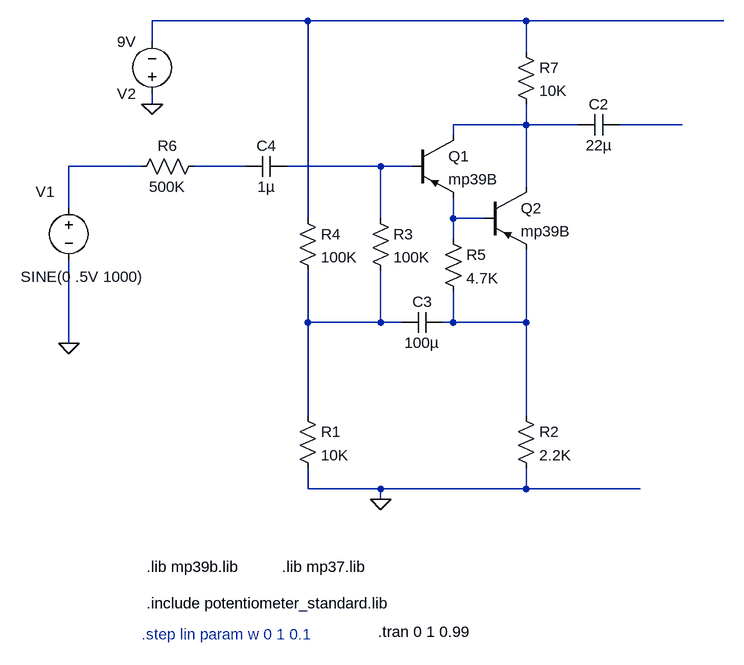
[diagram p0: schematic clean-preamp v3.asc]
clean-preamp v3.asc, the LTspice schematic file:
Version 4
SHEET 1 880 680
WIRE -1184 -912 -1424 -912
WIRE -848 -912 -1184 -912
WIRE -544 -912 -848 -912
WIRE -1424 -880 -1424 -912
WIRE -848 -864 -848 -912
WIRE -1424 -784 -1424 -800
WIRE -848 -752 -848 -784
WIRE -848 -752 -960 -752
WIRE -768 -752 -848 -752
WIRE -608 -752 -704 -752
WIRE -960 -736 -960 -752
WIRE -1440 -688 -1552 -688
WIRE -1280 -688 -1360 -688
WIRE -1072 -688 -1216 -688
WIRE -1024 -688 -1072 -688
WIRE -848 -656 -848 -752
WIRE -1552 -624 -1552 -688
WIRE -1184 -608 -1184 -912
WIRE -1072 -608 -1072 -688
WIRE -960 -608 -960 -640
WIRE -912 -608 -960 -608
WIRE -960 -576 -960 -608
WIRE -1184 -448 -1184 -528
WIRE -1072 -448 -1072 -528
WIRE -1072 -448 -1184 -448
WIRE -1040 -448 -1072 -448
WIRE -960 -448 -960 -496
WIRE -960 -448 -976 -448
WIRE -848 -448 -848 -560
WIRE -848 -448 -960 -448
WIRE -1552 -416 -1552 -544
WIRE -1184 -304 -1184 -448
WIRE -848 -304 -848 -448
WIRE -1184 -192 -1184 -224
WIRE -1072 -192 -1184 -192
WIRE -848 -192 -848 -224
WIRE -848 -192 -1072 -192
WIRE -672 -192 -848 -192
WIRE -1072 -176 -1072 -192
FLAG -1552 -416 0
FLAG -1424 -784 0
FLAG -1072 -176 0
SYMBOL voltage -1552 -640 R0
WINDOW 39 -112 95 Left 2
WINDOW 3 -74 122 Left 2
WINDOW 0 -51 -9 Left 2
SYMATTR Value SINE(0 .5V 1000)
SYMATTR InstName V1
SYMATTR Value2 AC 1
SYMBOL voltage -1424 -784 R180
WINDOW 123 0 0 Left 2
WINDOW 39 24 -12 Left 2
SYMATTR InstName V2
SYMATTR Value 9V
SYMBOL pnp -1024 -736 R0
SYMATTR InstName Q1
SYMATTR Value mp39B
SYMBOL res -1200 -320 R0
SYMATTR InstName R1
SYMATTR Value 10K
SYMBOL cap -704 -768 R90
WINDOW 0 0 32 VBottom 2
WINDOW 3 32 32 VTop 2
SYMATTR InstName C2
SYMATTR Value 22µ
SYMBOL res -864 -320 R0
SYMATTR InstName R2
SYMATTR Value 2.2K
SYMBOL cap -976 -464 R90
WINDOW 0 0 32 VBottom 2
WINDOW 3 32 32 VTop 2
SYMATTR InstName C3
SYMATTR Value 100µ
SYMBOL res -1088 -624 R0
SYMATTR InstName R3
SYMATTR Value 100K
SYMBOL res -1200 -624 R0
SYMATTR InstName R4
SYMATTR Value 100K
SYMBOL cap -1216 -704 R90
WINDOW 0 0 32 VBottom 2
WINDOW 3 32 32 VTop 2
SYMATTR InstName C4
SYMATTR Value 1µ
SYMBOL res -1344 -704 R90
WINDOW 0 0 56 VBottom 2
WINDOW 3 32 56 VTop 2
SYMATTR InstName R6
SYMATTR Value 500K
SYMBOL res -976 -592 R0
SYMATTR InstName R5
SYMATTR Value 4.7K
SYMBOL res -864 -880 R0
SYMATTR InstName R7
SYMATTR Value 10K
SYMBOL pnp -912 -656 R0
SYMATTR InstName Q2
SYMATTR Value mp39B
TEXT -1432 -72 Left 2 !.lib mp39b.lib
TEXT -1224 -72 Left 2 !.lib mp37.lib
TEXT -1432 -16 Left 2 !.include potentiometer_standard.lib
TEXT -1440 32 Left 2 ;.step lin param w 0 1 0.1
TEXT -1076 28 Left 2 !.tran 0 1 0.99

The netlist it stands for:
* clean-preamp v3.asc
V1 N004 0 SINE(0 .5V 1000) AC 1
V2 0 N001 9V
Q1 N002 N006 N007 0 mp39B
R1 N008 0 10K
C2 N003 N002 22µ
R2 N009 0 2.2K
C3 N009 N008 100µ
R3 N006 N008 100K
R4 N001 N008 100K
C4 N006 N005 1µ
R6 N005 N004 500K
R5 N007 N009 4.7K
R7 N001 N002 10K
Q2 N002 N007 N009 0 mp39B
.model NPN NPN
.model PNP PNP
.lib standard.bjt
.lib mp39b.lib
.lib mp37.lib
.include potentiometer_standard.lib
* .step lin param w 0 1 0.1
.tran 0 1 0.99
.backanno
.end